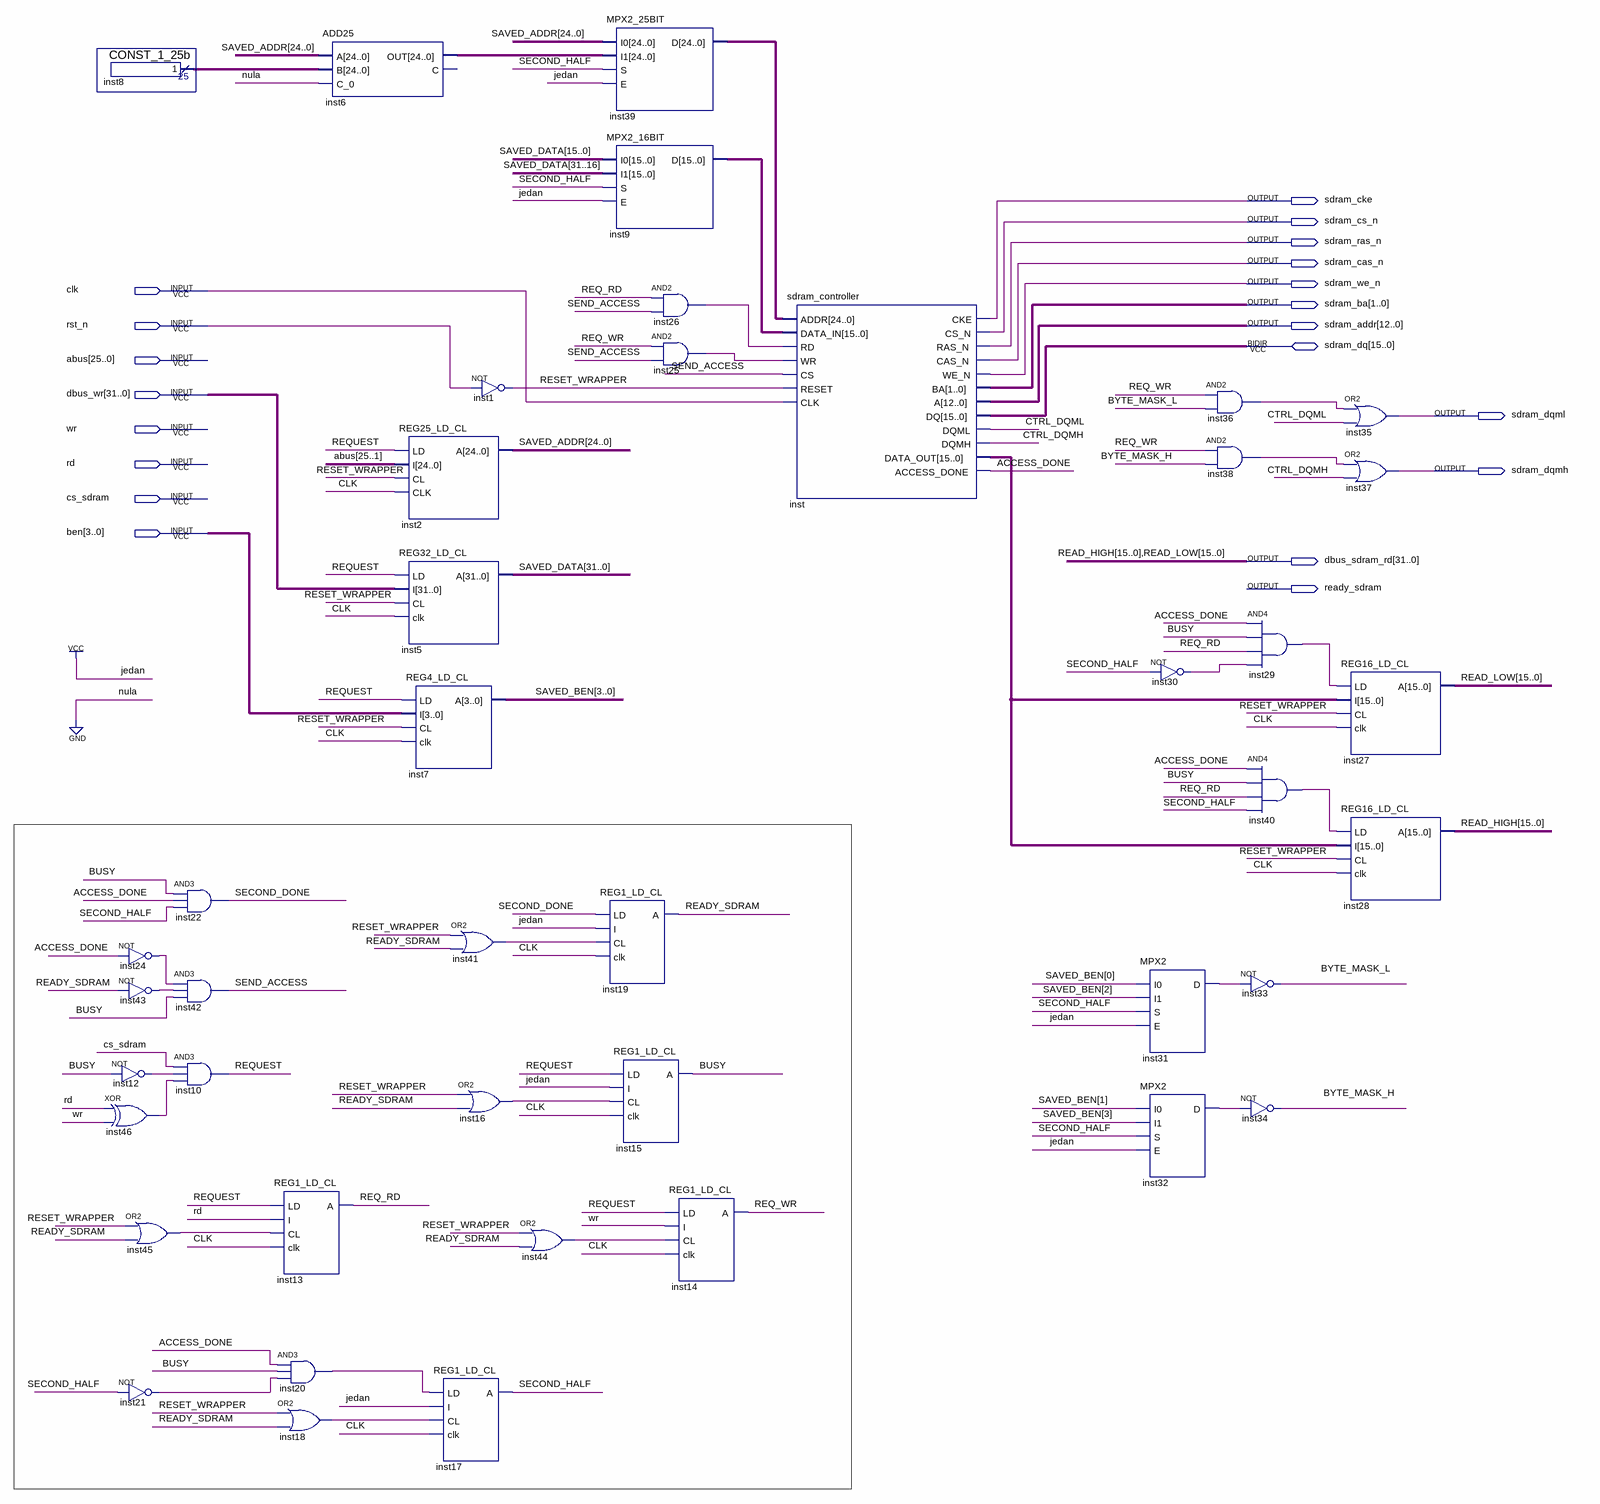
[diagram p0: schematic sheet]
// Quartus schematic sdram_wrapper.bdf as structural Verilog: 43 symbols, 20 pins
module sdram_wrapper (
  input  clk,
  input  rst_n,
  input  [25:0] abus,
  input  [31:0] dbus_wr,
  input  wr,
  input  rd,
  input  cs_sdram,
  input  [3:0] ben,
  inout  [15:0] sdram_dq,
  output sdram_cke,
  output sdram_cs_n,
  output sdram_ras_n,
  output sdram_cas_n,
  output sdram_we_n,
  output [1:0] sdram_ba,
  output [12:0] sdram_addr,
  output sdram_dqml,
  output sdram_dqmh,
  output [31:0] dbus_sdram_rd,
  output ready_sdram
);

  wire ACCESS_DONE, BUSY, BYTE_MASK_H, BYTE_MASK_L, CTRL_DQMH, CTRL_DQML, inst12_out, inst16_out, inst18_out,
       inst20_out, inst21_out, inst24_out, inst25_out, inst26_out, inst29_out, inst30_out, inst31_d,
       inst32_d, inst36_out, inst38_out, inst40_out, inst41_out, inst43_out, inst44_out, inst45_out,
       inst46_out, REQ_RD, REQ_WR, REQUEST, RESET_WRAPPER, SECOND_DONE, SECOND_HALF, SEND_ACCESS;
  wire [3:0] SAVED_BEN;
  wire [15:0] inst9_d, inst_data_out;
  wire [24:0] inst6_out, inst8_result, inst39_d, SAVED_ADDR;
  wire [31:0] SAVED_DATA;

  CONST_1_25b inst8 (.result(inst8_result));
  not inst24 (inst24_out, ACCESS_DONE);
  not inst43 (inst43_out, ready_sdram);
  not inst12 (inst12_out, BUSY);
  xor inst46 (inst46_out, rd, wr);
  or inst45 (inst45_out, RESET_WRAPPER, ready_sdram);
  not inst21 (inst21_out, SECOND_HALF);
  and inst22 (SECOND_DONE, BUSY, ACCESS_DONE, SECOND_HALF);
  and inst42 (SEND_ACCESS, inst24_out, inst43_out, BUSY);
  and inst10 (REQUEST, cs_sdram, inst12_out, inst46_out);
  REG1_LD_CL inst13 (.LD(REQUEST), .I(rd), .CL(inst45_out), .clk(clk), .A(REQ_RD));
  and inst20 (inst20_out, ACCESS_DONE, BUSY, inst21_out);
  or inst18 (inst18_out, RESET_WRAPPER, ready_sdram);
  ADD25 inst6 (.A(SAVED_ADDR), .B(inst8_result), .C_0(1'b0), .OUT(inst6_out));  // open: C
  REG25_LD_CL inst2 (.LD(REQUEST), .I(abus[25:1]), .CL(RESET_WRAPPER), .CLK(clk), .A(SAVED_ADDR));
  REG32_LD_CL inst5 (.LD(REQUEST), .I(dbus_wr), .CL(RESET_WRAPPER), .clk(clk), .A(SAVED_DATA));
  REG4_LD_CL inst7 (.LD(REQUEST), .I(ben), .CL(RESET_WRAPPER), .clk(clk), .A(SAVED_BEN));
  not inst1 (RESET_WRAPPER, rst_n);
  or inst41 (inst41_out, RESET_WRAPPER, ready_sdram);
  or inst16 (inst16_out, RESET_WRAPPER, ready_sdram);
  REG1_LD_CL inst17 (.LD(inst20_out), .I(1'b1), .CL(inst18_out), .clk(clk), .A(SECOND_HALF));
  or inst44 (inst44_out, RESET_WRAPPER, ready_sdram);
  MPX2_25BIT inst39 (.I0(SAVED_ADDR), .I1(inst6_out), .S(SECOND_HALF), .E(1'b1), .D(inst39_d));
  MPX2_16BIT inst9 (.I0(SAVED_DATA[15:0]), .I1(SAVED_DATA[31:16]), .S(SECOND_HALF), .E(1'b1), .D(inst9_d));
  REG1_LD_CL inst19 (.LD(SECOND_DONE), .I(1'b1), .CL(inst41_out), .clk(clk), .A(ready_sdram));
  REG1_LD_CL inst15 (.LD(REQUEST), .I(1'b1), .CL(inst16_out), .clk(clk), .A(BUSY));
  and inst26 (inst26_out, REQ_RD, SEND_ACCESS);
  and inst25 (inst25_out, REQ_WR, SEND_ACCESS);
  REG1_LD_CL inst14 (.LD(REQUEST), .I(wr), .CL(inst44_out), .clk(clk), .A(REQ_WR));
  sdram_controller inst (
    .ADDR(inst39_d), .DATA_IN(inst9_d), .RD(inst26_out), .WR(inst25_out), .CS(SEND_ACCESS),
    .RESET(RESET_WRAPPER), .CLK(clk), .CKE(sdram_cke), .CS_N(sdram_cs_n), .RAS_N(sdram_ras_n),
    .CAS_N(sdram_cas_n), .WE_N(sdram_we_n), .BA(sdram_ba), .A(sdram_addr), .DQML(CTRL_DQML),
    .DQMH(CTRL_DQMH), .DATA_OUT(inst_data_out), .ACCESS_DONE(ACCESS_DONE), .DQ(sdram_dq));
  MPX2 inst31 (.I0(SAVED_BEN[0]), .I1(SAVED_BEN[2]), .S(SECOND_HALF), .E(1'b1), .D(inst31_d));
  MPX2 inst32 (.I0(SAVED_BEN[1]), .I1(SAVED_BEN[3]), .S(SECOND_HALF), .E(1'b1), .D(inst32_d));
  not inst30 (inst30_out, SECOND_HALF);
  and inst36 (inst36_out, REQ_WR, BYTE_MASK_L);
  and inst38 (inst38_out, REQ_WR, BYTE_MASK_H);
  and inst29 (inst29_out, ACCESS_DONE, BUSY, REQ_RD, inst30_out);
  and inst40 (inst40_out, ACCESS_DONE, BUSY, REQ_RD, SECOND_HALF);
  not inst33 (BYTE_MASK_L, inst31_d);
  not inst34 (BYTE_MASK_H, inst32_d);
  or inst35 (sdram_dqml, inst36_out, CTRL_DQML);
  or inst37 (sdram_dqmh, inst38_out, CTRL_DQMH);
  REG16_LD_CL inst27 (.LD(inst29_out), .I(inst_data_out), .CL(RESET_WRAPPER), .clk(clk), .A(dbus_sdram_rd[15:0]));
  REG16_LD_CL inst28 (.LD(inst40_out), .I(inst_data_out), .CL(RESET_WRAPPER), .clk(clk), .A(dbus_sdram_rd[31:16]));

  // Other names for the same wires on the sheet: READ_HIGH[15:0] = dbus_sdram_rd[31:16];
  //   READ_LOW[15:0] = dbus_sdram_rd[15:0]
endmodule
